# Altium schematic sheet DRS_POT_LPFs.SchDoc
size A
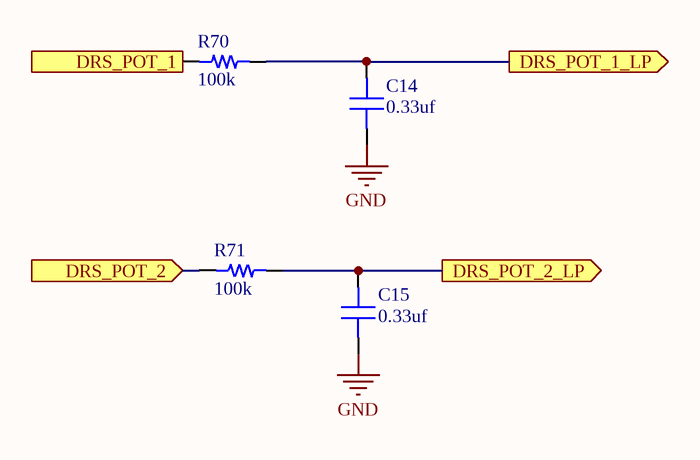
[diagram p0: DRS_POT_LPFs.SchDoc]

## Parts
C14  value 0.33uf  [CAP 0603/1608]  (hidden comment: Capacitor MLCC 0.33uf 16V CAP 0603/1608)
C15  value 0.33uf  [CAP 0603/1608]  (hidden comment: Capacitor MLCC 0.33uf 16V CAP 0603/1608)
R70  value 100k  [RES 0603/1608]  (hidden comment: Resistor 100k 0603 1/10W 1%)
R71  value 100k  [RES 0603/1608]  (hidden comment: Resistor 100k 0603 1/10W 1%)

## Ports
DRS_POT_1 (in), DRS_POT_1_LP (out), DRS_POT_2 (in), DRS_POT_2_LP (out)

## Nets
GND: C14.1 C15.1
DRS_POT_1: R70.1 ; port DRS_POT_1
DRS_POT_1_LP: C14.2 R70.2 ; port DRS_POT_1_LP
DRS_POT_2: R71.1 ; port DRS_POT_2
DRS_POT_2_LP: C15.2 R71.2 ; port DRS_POT_2_LP

## Library data of the parts
C14 C15 = 226: Manufacturer_id: 1; idCapacitor: 226; Name: Cap_0.33uf_16V_CAP 0603/1608; Dielectric: Ceramic; Created_By: Nick Mah; Drawer_id: 1; Voltage_Rating: 16V; Package: CAP 0603/1608; Created_Date: 10/20/2018
R70 R71 = 337: Manufacturer_id: 1; idResistor: 337; Name: Res_100k_0603_1/10W_1%; Created_By: Nick Mah; Supplier 1: Digi-Key; Drawer_id: 1; Tolerance: 1%; Power: 1/10W; Package: 0603; ComponentLink1Description: Datasheet; Created_Date: 2018-10-20